# EAGLE design step_board (EAGLE 7.1.0)
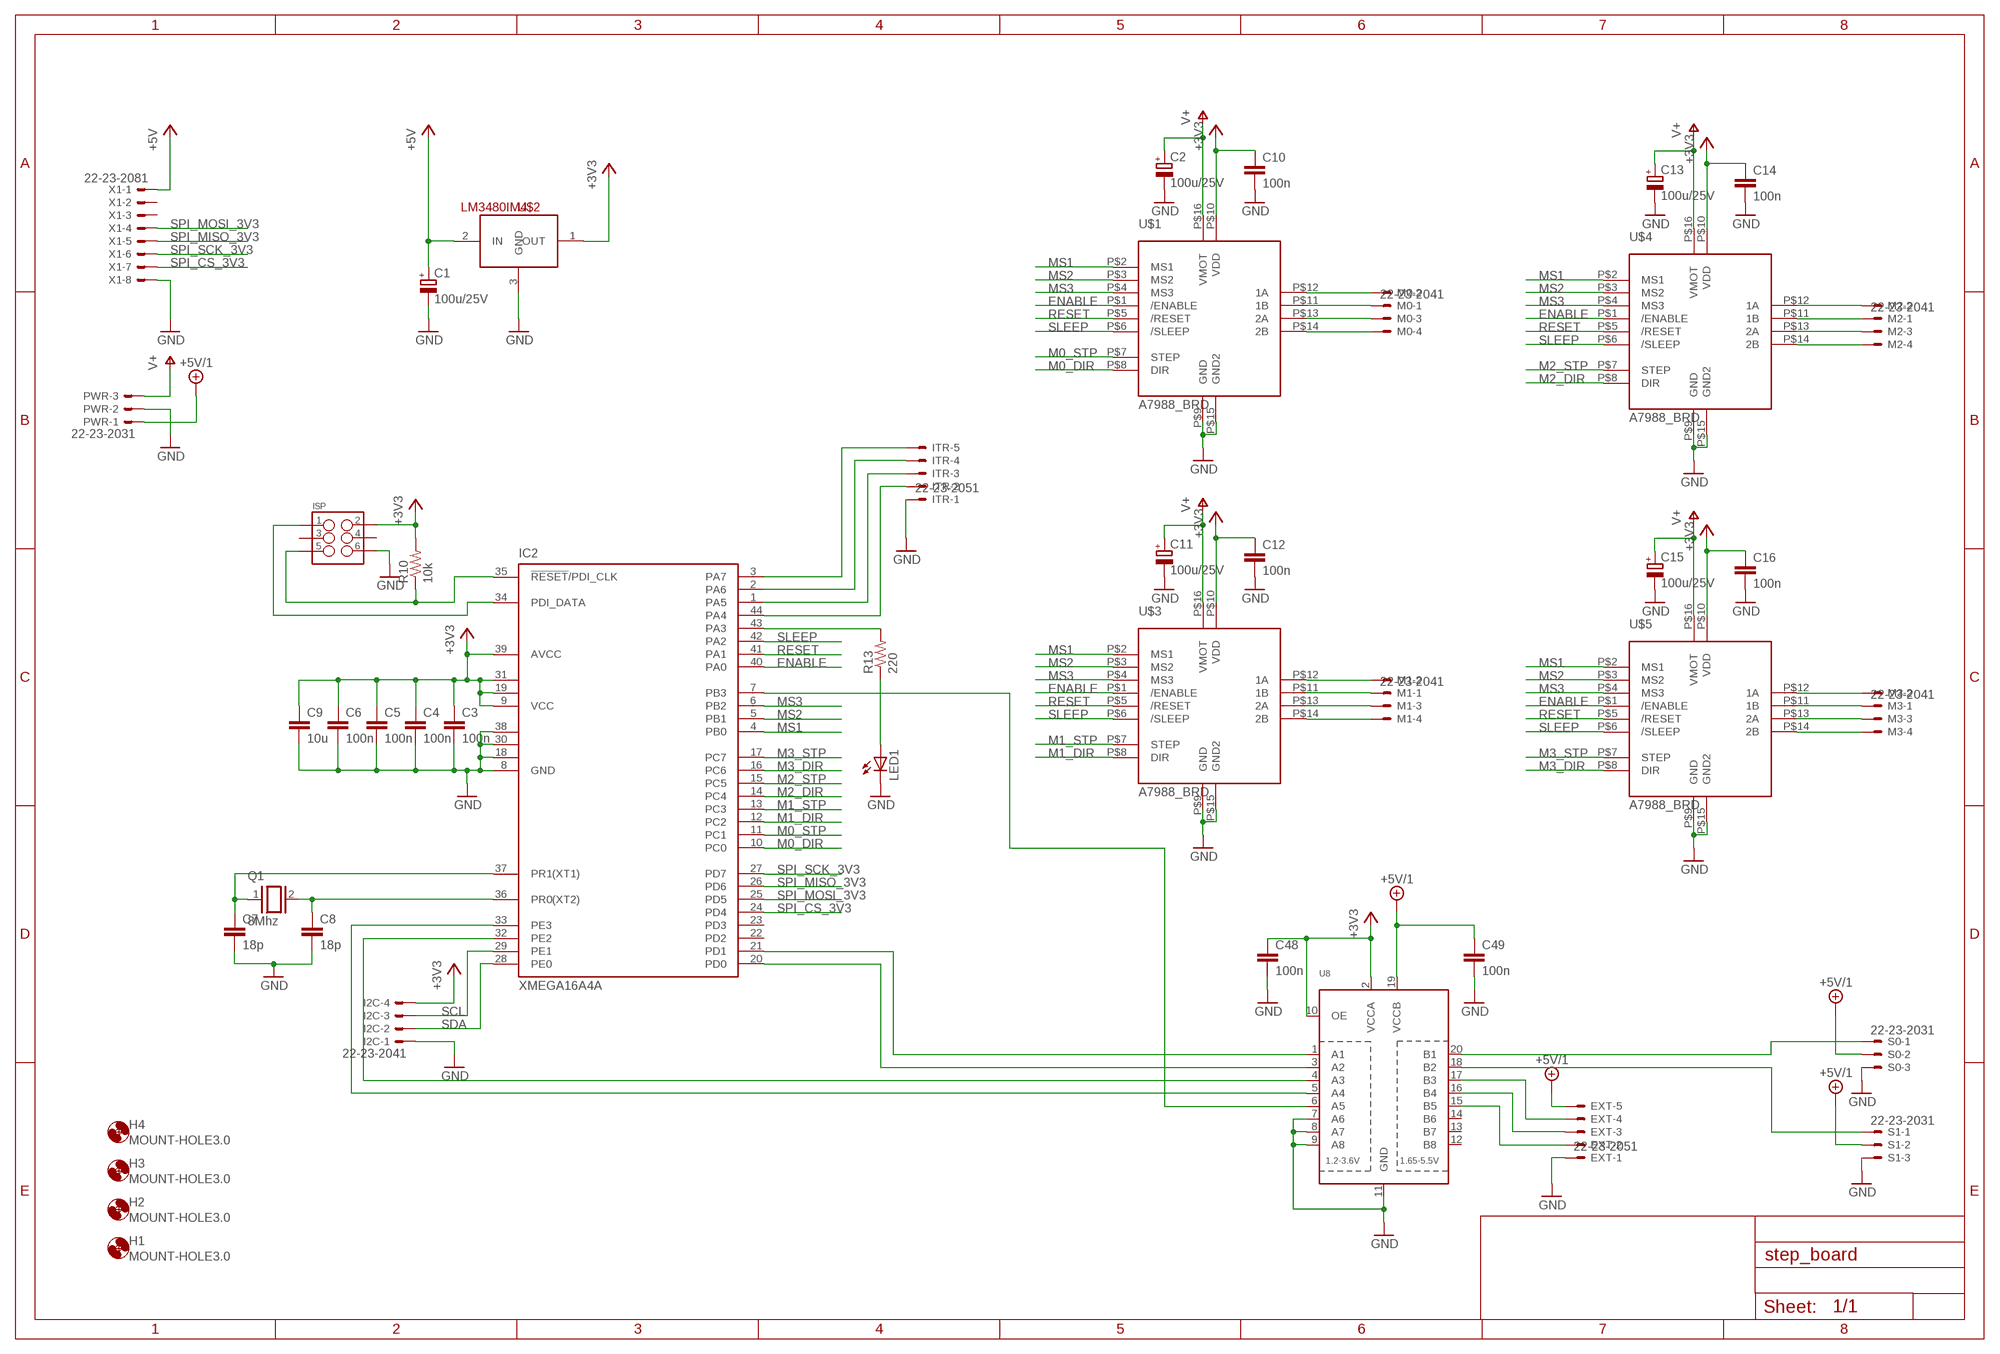
[diagram p0: schematic, sheet 1]

## Parts
C1  100u/25V  CPOL-EUE  [PANASONIC_E]
C2  100u/25V  CPOL-EUE  [PANASONIC_E]
C3  100n  C-EUC0603  [C0603]
C4  100n  C-EUC0603  [C0603]
C5  100n  C-EUC0603  [C0603]
C6  100n  C-EUC0603  [C0603]
C7  18p  C-EUC0603  [C0603]
C8  18p  C-EUC0603  [C0603]
C9  10u  C-EUC0805  [C0805]
C10  100n  C-EUC0603  [C0603]
C11  100u/25V  CPOL-EUE  [PANASONIC_E]
C12  100n  C-EUC0603  [C0603]
C13  100u/25V  CPOL-EUE  [PANASONIC_E]
C14  100n  C-EUC0603  [C0603]
C15  100u/25V  CPOL-EUE  [PANASONIC_E]
C16  100n  C-EUC0603  [C0603]
C48  100n  C-EUC0603K  [C0603K]
C49  100n  C-EUC0603K  [C0603K]
EXT  22-23-2051  [22-23-2051]
H1  MOUNT-HOLE3.0  [3,0]
H2  MOUNT-HOLE3.0  [3,0]
H3  MOUNT-HOLE3.0  [3,0]
H4  MOUNT-HOLE3.0  [3,0]
I2C  22-23-2041  [22-23-2041]
IC2  XMEGA16A4A  [TQFP44]
ISP  M03X2POGO_PINS  [2X3_POGO]
ITR  22-23-2051  [22-23-2051]
LED1  LEDCHIP-LED0603  [CHIP-LED0603]
M0  22-23-2041  [22-23-2041]
M1  22-23-2041  [22-23-2041]
M2  22-23-2041  [22-23-2041]
M3  22-23-2041  [22-23-2041]
PWR  22-23-2031  [22-23-2031]
Q1  8Mhz  XTAL/S  [QS]
R10  10k  R-US_R0603  [R0603]
R13  220  R-US_R0603  [R0603]
S0  22-23-2031  [22-23-2031]
S1  22-23-2031  [22-23-2031]
U8  TXB0108PWR  [TSSOP20]
U$1  A7988_BRD  [A4988_BRD]
U$2  LM3480IM4  [SOT23-3]
U$3  A7988_BRD  [A4988_BRD]
U$4  A7988_BRD  [A4988_BRD]
U$5  A7988_BRD  [A4988_BRD]
X1  22-23-2081  [22-23-2081]

## Nets
+3V3: C3.1 C4.1 C5.1 C6.1 C9.1 C10.1 C12.1 C14.1 C16.1 C48.1 I2C.4 IC2.9(VCC) IC2.19(VCC1) IC2.31(VCC2) IC2.39(AVCC) ISP.P$2 R10.2 U8.2(VCCA) U8.10(OE) U$1.P$10(VDD) U$2.1(OUT) U$3.P$10(VDD) U$4.P$10(VDD) U$5.P$10(VDD)
+5V: C1.+ U$2.2(IN) X1.1
+5V/1: C49.1 EXT.5 PWR.1 S0.2 S1.2 U8.19(VCCB)
ENABLE: IC2.40(PA0) U$1.P$1(/ENABLE) U$3.P$1(/ENABLE) U$4.P$1(/ENABLE) U$5.P$1(/ENABLE)
GND: C1.- C2.- C3.2 C4.2 C5.2 C6.2 C7.2 C8.2 C9.2 C10.2 C11.- C12.2 C13.- C14.2 C15.- C16.2 C48.2 C49.2 EXT.1 I2C.1 IC2.8(GND) IC2.18(GND1) IC2.30(GND2) IC2.38(GND3) ISP.P$6 ITR.1 LED1.C PWR.2 S0.3 S1.3 U8.7(A6) U8.8(A7) U8.9(A8) U8.11(GND) U$1.P$9(GND) U$1.P$15(GND2) U$2.3(GND) U$3.P$9(GND) U$3.P$15(GND2) U$4.P$9(GND) U$4.P$15(GND2) U$5.P$9(GND) U$5.P$15(GND2) X1.8
M0_DIR: IC2.10(PC0) U$1.P$8(DIR)
M0_STP: IC2.11(PC1) U$1.P$7(STEP)
M1_DIR: IC2.12(PC2) U$3.P$8(DIR)
M1_STP: IC2.13(PC3) U$3.P$7(STEP)
M2_DIR: IC2.14(PC4) U$4.P$8(DIR)
M2_STP: IC2.15(PC5) U$4.P$7(STEP)
M3_DIR: IC2.16(PC6) U$5.P$8(DIR)
M3_STP: IC2.17(PC7) U$5.P$7(STEP)
MS1: IC2.4(PB0) U$1.P$2(MS1) U$3.P$2(MS1) U$4.P$2(MS1) U$5.P$2(MS1)
MS2: IC2.5(PB1) U$1.P$3(MS2) U$3.P$3(MS2) U$4.P$3(MS2) U$5.P$3(MS2)
MS3: IC2.6(PB2) U$1.P$4(MS3) U$3.P$4(MS3) U$4.P$4(MS3) U$5.P$4(MS3)
N$1: M0.1 U$1.P$11(1B)
N$2: M0.2 U$1.P$12(1A)
N$3: M2.1 U$4.P$11(1B)
N$4: LED1.A R13.1
N$5: IC2.34(PDI_DATA) ISP.P$1
N$6: C8.1 IC2.36(PR0(XT2)) Q1.2
N$7: C7.1 IC2.37(PR1(XT1)) Q1.1
N$8: M2.2 U$4.P$12(1A)
N$9: M0.3 U$1.P$13(2A)
N$10: IC2.35(!RESET!/PDI_CLK) ISP.P$5 R10.1
N$11: M0.4 U$1.P$14(2B)
N$12: IC2.43(PA3) R13.2
N$13: M1.3 U$3.P$13(2A)
N$14: M1.4 U$3.P$14(2B)
N$15: M1.1 U$3.P$11(1B)
N$16: M1.2 U$3.P$12(1A)
N$17: M2.3 U$4.P$13(2A)
N$18: M2.4 U$4.P$14(2B)
N$19: M3.1 U$5.P$11(1B)
N$20: M3.2 U$5.P$12(1A)
N$21: M3.3 U$5.P$13(2A)
N$22: M3.4 U$5.P$14(2B)
N$23: S0.1 U8.20(B1)
N$24: IC2.20(PD0) U8.3(A2)
N$25: IC2.21(PD1) U8.1(A1)
N$26: S1.1 U8.18(B2)
N$27: IC2.32(PE2) U8.4(A3)
N$28: IC2.33(PE3) U8.5(A4)
N$29: IC2.44(PA4) ITR.2
N$30: EXT.4 U8.17(B3)
N$31: EXT.3 U8.16(B4)
N$32: EXT.2 U8.15(B5)
N$33: IC2.1(PA5) ITR.3
N$34: IC2.2(PA6) ITR.4
N$35: IC2.3(PA7) ITR.5
N$37: IC2.7(PB3) U8.6(A5)
RESET: IC2.41(PA1) U$1.P$5(/RESET) U$3.P$5(/RESET) U$4.P$5(/RESET) U$5.P$5(/RESET)
SCL: I2C.3 IC2.29(PE1)
SDA: I2C.2 IC2.28(PE0)
SLEEP: IC2.42(PA2) U$1.P$6(/SLEEP) U$3.P$6(/SLEEP) U$4.P$6(/SLEEP) U$5.P$6(/SLEEP)
SPI_CS_3V3: IC2.24(PD4) X1.7
SPI_MISO_3V3: IC2.26(PD6) X1.5
SPI_MOSI_3V3: IC2.25(PD5) X1.4
SPI_SCK_3V3: IC2.27(PD7) X1.6
V+: C2.+ C11.+ C13.+ C15.+ PWR.3 U$1.P$16(VMOT) U$3.P$16(VMOT) U$4.P$16(VMOT) U$5.P$16(VMOT)
Unconnected: IC2.22(PD2) IC2.23(PD3) ISP.P$3 ISP.P$4 U8.12(B8) U8.13(B7) U8.14(B6) X1.2 X1.3

## Library data of the parts
C1 C2 C11 C13 C15 = rcl:CPOL-EU: POLARIZED CAPACITOR, European symbol
C3-C10 C12 C14 C16 C48 C49 = rcl:C-EU: CAPACITOR, European symbol
EXT ITR = con-molex:22-23-2051: .100" (2.54mm) Center Header - 5 Pin; MF: MOLEX; MPN: 22-23-2051; OC_FARNELL: 1462952; OC_NEWARK: 38C9178
H1-H4 = holes:MOUNT-HOLE: MOUNTING HOLE with drill center marker
I2C M0 M1-M3 = con-molex:22-23-2041: .100" (2.54mm) Center Header - 4 Pin; MF: MOLEX; MPN: 22-23-2041; OC_FARNELL: 1462920; OC_NEWARK: 38C0355
IC2 = atmel:XMEGA16A4: MICROCONTROLLER Features High-performance, Low-power 8/16-bit AVR XMEGA Microcontroller Non-Volatile Program and Data Memories - 16 KB - 128 KB of In-System Self-Programmable Flash - 4 KB - 8 KB Boot Code Section with Independent Lock Bits - 1 KB - 2 KB EEPROM - 2 KB - 8 KB Internal SRAM Peripheral Features - Four-channel DMA Controller with support for external requests - Eight-channel Event System - Five 16-bit Timer/Counters Three Timer/Counters with 4 Output Compare or Input Capture channels Two Timer/Counters with 2 Output Compare or Input Capture channels High-Resolution Extensions on all Timer/Counters Advanced Waveform Extension on one Timer/Counter - Five USARTs IrDA Extension on one USART - Two Two-Wire Interfaces with dual address match (I2C and SMBus compatible) - Two SPIs (Serial Peripheral Interfaces) peripherals - AES and DES Crypto Engine - 16-bit Real Time Counter with Separate Oscillator - One Twelve-channel, 12-bit, 2 Msps Analog to Digital Converter - One Two-channel, 12-bit, 1 Msps Digital to Analog Converter - Two Analog Comparators with Window compare function - External Interrupts on all General Purpose I/O pins - Programmable Watchdog Timer with Separate On-chip Ultra Low Power Oscillator Special Microcontroller Features - Power-on Reset and Programmable Brown-out Detection - Internal and External Clock Options with PLL - Programmable Multi-level Interrupt Controller - Sleep Modes: Idle, Power-down, Standby, Power-save, Extended Standby - Advanced Programming, Test and Debugging Interfaces PDI (Program and Debug Interface) for programming, test and debugging I/O and Packages - 34 Programmable I/O Lines - 44 - lead TQFP - 44 - pad VQFN/QFN - 49 - ball VFBGA Operating Voltage - 1.6 - 3.6V Speed performance - 0 - 12 MHz @ 1.6 - 3.6V - 0 - 32 MHz @ 2.7 - 3.6V Drawn by Dipl.-Ing. (FH) Robert Siegler Created: 27.05.09; OC_FARNELL: unknown; OC_NEWARK: unknown
ISP = SparkFun-Connectors:M03X2: 2x3 .1" header. Shrouded, with keying- CONN-10681 SMT- CONN-11415 Pogo pins- HW-11044; PROD_ID: HW-11044
LED1 = led:LED: LED OSRAM: - CHIPLED LG R971, LG N971, LY N971, LG Q971, LY Q971, LO R971, LY R971 LH N974, LH R974 LS Q976, LO Q976, LY Q976 LO Q996 - Hyper CHIPLED LW Q18S LB Q993, LB Q99A, LB R99A - SideLED LS A670, LO A670, LY A670, LG A670, LP A670 LB A673, LV A673, LT A673, LW A673 LH A674 LY A675 LS A676, LA A676, LO A676, LY A676, LW A676 LS A679, LY A679, LG A679 - Hyper Micro SIDELED® LS Y876, LA Y876, LO Y876, LY Y876 LT Y87S - SmartLED LW L88C, LW L88S LB L89C, LB L89S, LG L890 LS L89K, LO L89K, LY L89K LS L896, LA L896, LO L896, LY L896 - TOPLED LS T670, LO T670, LY T670, LG T670, LP T670 LSG T670, LSP T670, LSY T670, LOP T670, LYG T670 LG T671, LOG T671, LSG T671 LB T673, LV T673, LT T673, LW T673 LH T674 LS T676, LA T676, LO T676, LY T676, LB T676, LH T676, LSB T676, LW T676 LB T67C, LV T67C, LT T67C, LS T67K, LO T67K, LY T67K, LW E67C LS E67B, LA E67B, LO E67B, LY E67B, LB E67C, LV E67C, LT E67C LW T67C LS T679, LY T679, LG T679 LS T770, LO T770, LY T770, LG T770, LP T770 LB T773, LV T773, LT T773, LW T773 LH T774 LS E675, LA E675, LY E675, LS T675 LS T776, LA T776, LO T776, LY T776, LB T776 LHGB T686 LT T68C, LB T68C - Hyper Mini TOPLED® LB M676 - Mini TOPLED Santana® LG M470 LS M47K, LO M47K, LY M47K Source: http://www.osram.convergy.de LUXEON: - LUMILED® LXK2-PW12-R00, LXK2-PW12-S00, LXK2-PW14-U00, LXK2-PW14-V00 LXK2-PM12-R00, LXK2-PM12-S00, LXK2-PM14-U00 LXK2-PE12-Q00, LXK2-PE12-R00, LXK2-PE12-S00, LXK2-PE14-T00, LXK2-PE14-U00 LXK2-PB12-K00, LXK2-PB12-L00, LXK2-PB12-M00, LXK2-PB14-N00, LXK2-PB14-P00, LXK2-PB14-Q00 LXK2-PR12-L00, LXK2-PR12-M00, LXK2-PR14-Q00, LXK2-PR14-R00 LXK2-PD12-Q00, LXK2-PD12-R00, LXK2-PD12-S00 LXK2-PH12-R00, LXK2-PH12-S00 LXK2-PL12-P00, LXK2-PL12-Q00, LXK2-PL12-R00 Source: www.luxeon.com KINGBRIGHT: KA-3528ASYC Source: www.kingbright.com
PWR S0 S1 = con-molex:22-23-2031: .100" (2.54mm) Center Header - 3 Pin; MF: MOLEX; MPN: 22-23-2031; OC_FARNELL: 1462950; OC_NEWARK: 30C0862
Q1 = special:XTAL/S: CRYSTAL
R10 R13 = rcl:R-US_: RESISTOR, American symbol
U8 = adafruit:TXB0108PWR: 8-Bit Bi-Directional Level Shifter 1.2V-3.6V (VCCA) to 1.65V-5.5V (VCCB) bi-directional level shifter with auto direction sensing. Max data rate - VCCA 1.8V: 20Mbps (50ns), VCCA 3.3V: 100Mbps (10ns) Digikey: 296-21527-1-ND
U$1 U$3-U$5 = perso:A7988_BRD
U$2 = SparkFun-PowerIC:LM3480IM4: Small package linear regulator
X1 = con-molex:22-23-2081: .100" (2.54mm) Center Header - 8 Pin; MF: MOLEX; MPN: 22-23-2081; OC_FARNELL: 1756826; OC_NEWARK: 01C7592

## Board
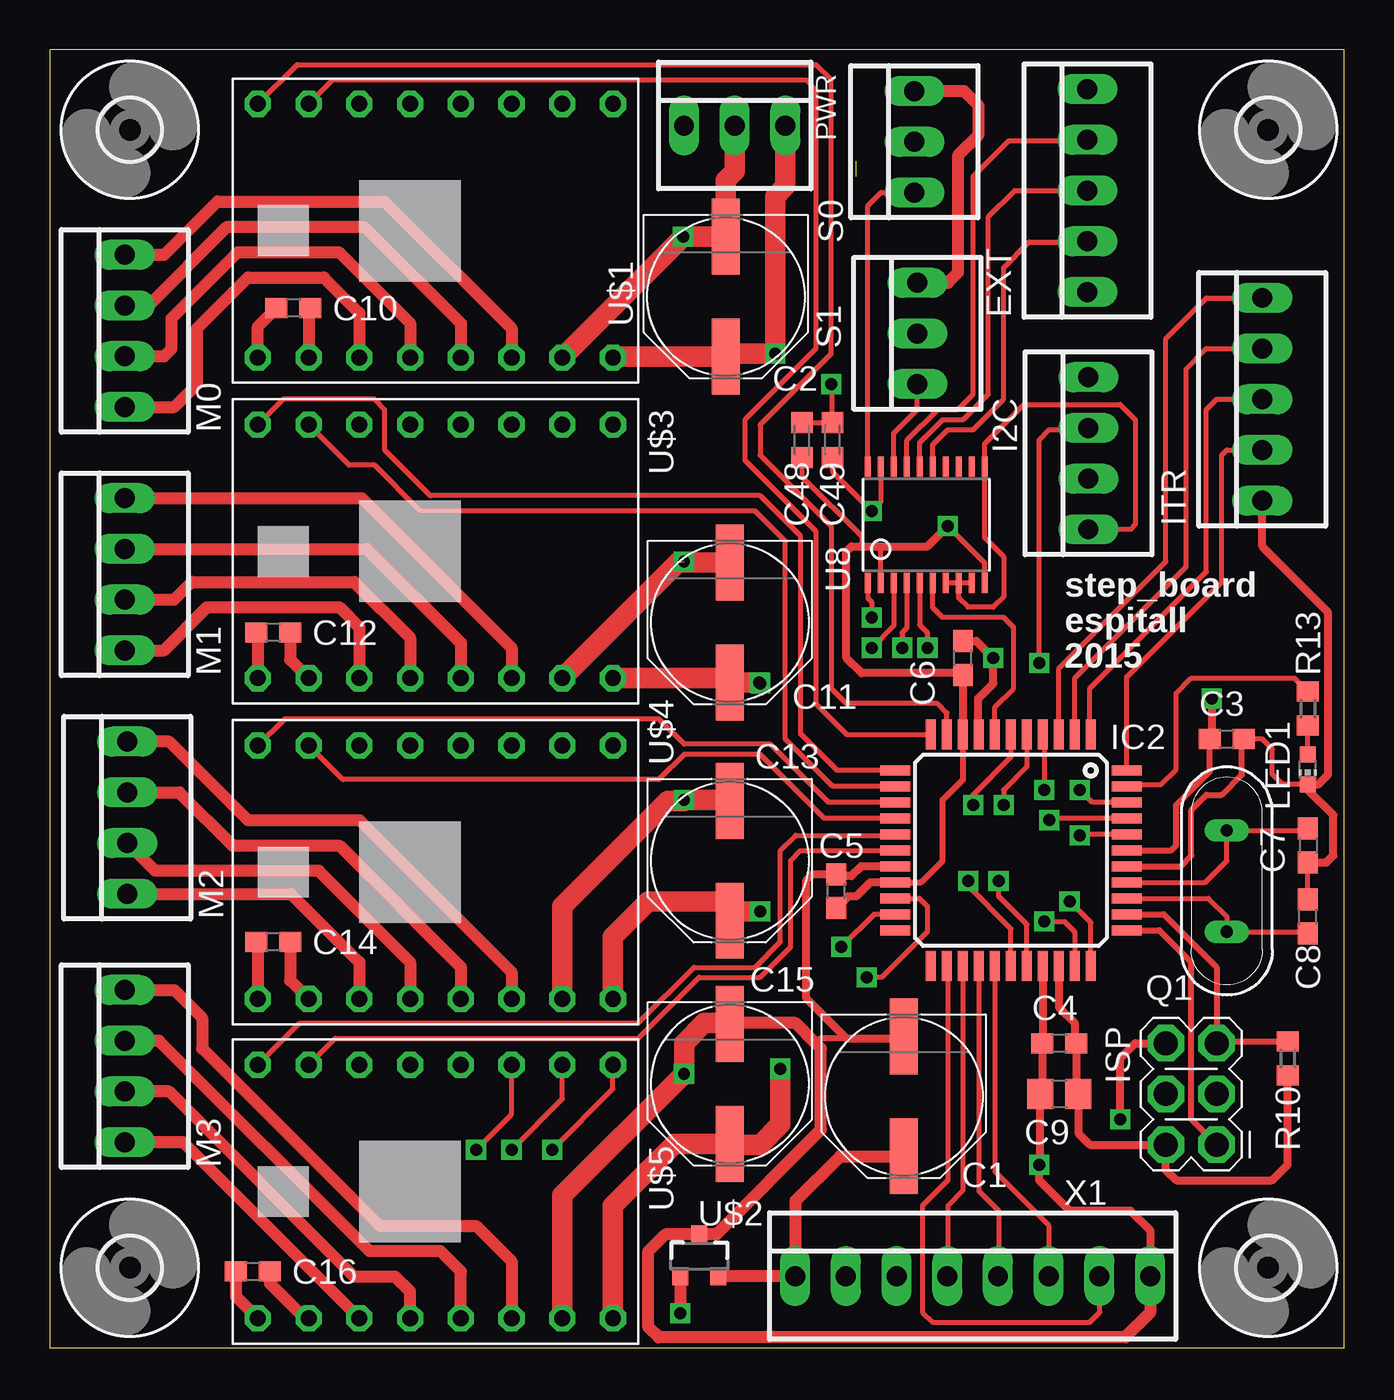
[diagram p1: board, top side]
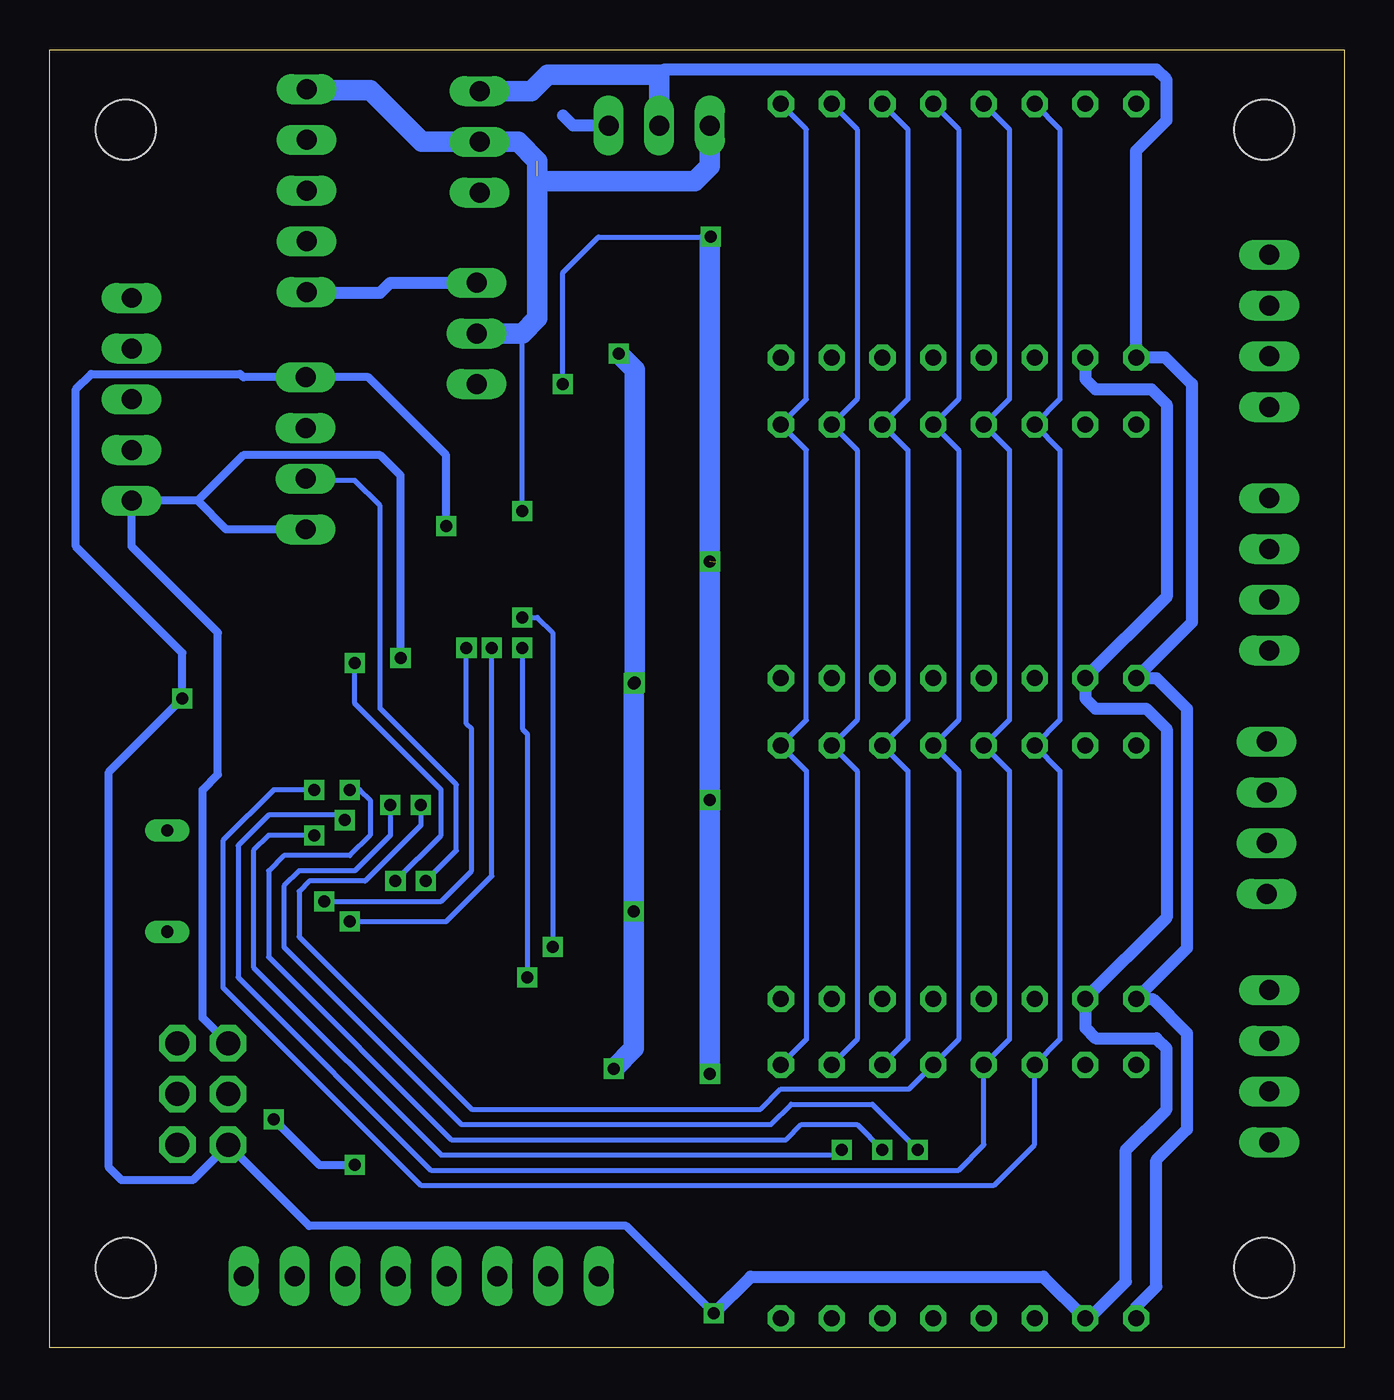
[diagram p2: board, bottom side, seen from below]

Size 64.8 x 65 mm. Coordinates in mm from the lower left corner, seen from the top.
Outline: 0,0 64.8,0 64.8,65 0,65 0,0
Copper layers (1*16): Top 0.035mm / dielectric 1.5mm / Bottom 0.035mm
Design rules "default": minimum track width 10mil, minimum drill 24mil, track to track 8mil, track to pad 8mil, pad to pad 8mil, via to via 8mil, smd to smd 8mil, copper to edge 40mil, drill to drill 8mil, minimum pad ring 10mil, minimum via ring 8mil, stop-mask expansion 4mil, vias tented up to drill 0mil, thermal gap 10mil

### Footprints (pad centres in the part's own frame; a part is rotated, then mirrored left to right if it is on the bottom)
PANASONIC_E = smd 3.8 x 1.4: + 3,0; - -3,0
C0603 = smd 1.1 x 1: 1 -0.85,0; 2 0.85,0
C0805 = smd 1.3 x 1.5: 1 -0.95,0; 2 0.95,0
C0603K = smd 1.05 x 1.08: 1 -0.875,0; 2 0.875,0
22-23-2051 = drill 1 long: 1 -5.08,0; 2 -2.54,0; 3 0,0; 4 2.54,0; 5 5.08,0
3,0 = hole 3: 0,0
22-23-2041 = drill 1 long: 1 -3.81,0; 2 -1.27,0; 3 1.27,0; 4 3.81,0
TQFP44 = smd 1.5 x 0.5: 1 -5.8,4; 2 -5.8,3.2; 3 -5.8,2.4; 4 -5.8,1.6; 5 -5.8,0.8; 6 -5.8,0; 7 -5.8,-0.8; 8 -5.8,-1.6; 9 -5.8,-2.4; 10 -5.8,-3.2; 11 -5.8,-4; 23 5.8,-4; 24 5.8,-3.2; 25 5.8,-2.4; 26 5.8,-1.6; 27 5.8,-0.8; 28 5.8,0; 29 5.8,0.8; 30 5.8,1.6; 31 5.8,2.4; 32 5.8,3.2; 33 5.8,4 | smd 0.5 x 1.5: 12 -4,-5.8; 13 -3.2,-5.8; 14 -2.4,-5.8; 15 -1.6,-5.8; 16 -0.8,-5.8; 17 0,-5.8; 18 0.8,-5.8; 19 1.6,-5.8; 20 2.4,-5.8; 21 3.2,-5.8; 22 4,-5.8; 34 4,5.8; 35 3.2,5.8; 36 2.4,5.8; 37 1.6,5.8; 38 0.8,5.8; 39 0,5.8; 40 -0.8,5.8; 41 -1.6,5.8; 42 -2.4,5.8; 43 -3.2,5.8; 44 -4,5.8
2X3_POGO = drill 1.2 pad 1.829 octagon: P$1 0,0; P$2 0,2.54; P$3 2.54,0; P$4 2.54,2.54; P$5 5.08,0; P$6 5.08,2.54
CHIP-LED0603 = smd 0.8 x 0.8: A 0,-0.75; C 0,0.75
22-23-2031 = drill 1 long: 1 -2.54,0; 2 0,0; 3 2.54,0
QS = drill 0.61 long: 1 -2.54,0; 2 2.54,0
R0603 = smd 1 x 1.1: 1 -0.85,0; 2 0.85,0
TSSOP20 = smd 0.305 x 0.991: 1 -2.925,-2.918; 2 -2.275,-2.918; 3 -1.625,-2.918; 4 -0.975,-2.918; 5 -0.325,-2.918; 6 0.325,-2.918; 7 0.975,-2.918; 8 1.625,-2.918; 9 2.275,-2.918; 10 2.925,-2.918; 11 2.925,2.918; 12 2.275,2.918; 13 1.625,2.918; 14 0.975,2.918; 15 0.325,2.918; 16 -0.325,2.918; 17 -0.975,2.918; 18 -1.625,2.918; 19 -2.275,2.918; 20 -2.925,2.918
A4988_BRD = drill 0.8 octagon: P$1 -6.35,8.89; P$2 -6.35,6.35; P$3 -6.35,3.81; P$4 -6.35,1.27; P$5 -6.35,-1.27; P$6 -6.35,-3.81; P$7 -6.35,-6.35; P$8 -6.35,-8.89; P$9 6.35,-8.89; P$10 6.35,-6.35; P$11 6.35,-3.81; P$12 6.35,-1.27; P$13 6.35,1.27; P$14 6.35,3.81; P$15 6.35,6.35; P$16 6.35,8.89
SOT23-3 = smd 0.8 x 0.9: 1 -0.95,-1; 2 0.95,-1; 3 0,1.1
22-23-2081 = drill 1 long: 1 -8.89,0; 2 -6.35,0; 3 -3.81,0; 4 -1.27,0; 5 1.27,0; 6 3.81,0; 7 6.35,0; 8 8.89,0

### Placement (x,y rotation side)
C1  42.75,12.59 270 top
C2  33.85,52.64 270 top
C3  58.93,30.48 0 top
C4  50.55,15.24 180 top
C5  39.37,22.86 90 top
C6  45.72,34.54 90 top
C7  62.99,25.15 270 top
C8  62.99,21.59 90 top
C9  50.55,12.7 180 top
C10  12.19,52.07 180 top
C11  34.04,36.32 270 top
C12  11.18,35.81 180 top
C13  34.04,24.38 270 top
C14  11.18,20.32 180 top
C15  34.04,13.21 270 top
C16  10.16,3.81 180 top
C48  37.66,45.47 90 top
C49  39.18,45.47 90 top
EXT  51.95,57.95 90 top
H1  4,4 0 top
H2  61,4 0 top
H3  61,61 0 top
H4  4,61 0 top
I2C  52,44.8 90 top
IC2  48.12,24.91 270 top
ISP  58.42,10.16 90 top
ITR  60.71,47.5 90 top
LED1  62.99,28.96 180 top
M0  3.75,50.93 90 top
M1  3.75,38.73 90 top
M2  3.87,26.54 90 top
M3  3.75,14.1 90 top
PWR  34.29,61.21 0 top
Q1  58.93,23.37 270 top
R10  61.98,14.48 270 top
R13  62.99,32 90 top
S0  43.28,60.4 90 top
S1  43.43,50.8 90 top
U8  43.88,41.21 0 top
U$1  19.3,55.94 270 top
U$2  32.51,4.57 0 top
U$3  19.3,39.88 270 top
U$4  19.3,23.81 270 top
U$5  19.3,7.81 270 top
X1  46.2,3.58 0 top

### Tracks (layer width: path | path; a pad name or v marks a point on that pad's centre or on a via)
+3V3  (via drill 0.6)
  Top 0.254: C48.1 37.66,43.62 40.64,40.64 40.64,40.13 | U8.10 46.8,39.3 v44.96,41.15 | U8.2 41.6,39.93 41.4,40.13
  Top 0.305: IC2.39 56.15,24.91 56.39,25.15 56.39,27.18 58.08,28.87 C3.1 | IC2.19 43.63,23.31 44.7,24.38 44.7,27.43 45.72,28.45 IC2.9
  Top 0.406: IC2.31 50.52,17.05 51.31,16.26 51.31,15.33 C4.1 51.4,12.8 C9.1 51.5,10.73 52.07,10.16 ISP.P$2 55.88,8.89 56.39,8.38 61.21,8.38 61.98,9.14 R10.2 | IC2.9 C6.1 45.63,33.78 40.64,33.78 39.88,34.54 39.88,39.88 40.13,40.13 40.64,40.13 41.4,40.13 43.94,40.13 v44.96,41.15 | IC2.19 41.09,23.31 40.39,22.61 39.97,22.61 C5.1 | v58.17,32.51 58.17,30.57 C3.1
  Top 0.61: C16.1 11.01,3.21 12.76,1.46 U$5.P$10 | C14.1 12.03,18.39 U$4.P$10 | C12.1 12.03,34.46 U$3.P$10 | C10.1 12.95,51.98 U$1.P$10 | U$2.1 v31.56,1.71
  Bottom 0.406: v31.56,1.71 35.95,6.1 51.82,6.1 ISP.P$2 57.66,8.38 61.21,8.38 61.85,9.02 61.85,28.83 v58.17,32.51 58.17,34.8 63.5,40.13 63.5,48.01 62.74,48.77 55.28,48.77 55.12,48.61 I2C.4 48.86,48.61 44.96,44.7 v44.96,41.15
  Bottom 0.61: U$1.P$10 12.95,48.51 12.45,48.01 9.65,48.01 8.89,47.24 8.89,37.59 U$3.P$10 12.95,32.51 12.45,32 9.91,32 8.89,30.99 8.89,21.53 U$4.P$10 12.95,16 12.45,15.49 9.4,15.49 8.89,14.99 8.89,11.94 10.92,9.91 10.92,3.3 12.76,1.46 U$5.P$10 15.05,3.56 29.72,3.56 v31.56,1.71
+5V
  Top 0.406: X1.1 37.34,3.6
  Top 0.61: U$2.2 X1.1 37.34,3.6 37.34,7.37 39.56,9.59 C1.+
+5V/1  (via drill 0.6)  (1 unrouted)
  Top 0.254: U8.19 41.6,42.37 v41.15,41.91 39.18,43.88 C49.1
  Bottom 0.254: v41.15,41.91 41.15,50.8 41.15,51.31
  Bottom 1.016: PWR.1 31.75,59.18 32.51,58.42 40.13,58.42 40.39,58.67 | S1.2 41.15,50.8 40.39,51.56 40.39,59.44 41.35,60.4 S0.2 46.17,60.4 48.77,62.99 51.91,62.99 EXT.5
ENABLE  (via drill 0.6)
  Top 0.254: IC2.40 51.62,25.71 v51.56,25.65 | v25.15,9.91 28.19,12.95 U$5.P$1
  Bottom 0.254: U$5.P$1 26.92,15.43 26.92,28.89 U$4.P$1 26.92,31.43 26.92,44.96 U$3.P$1 26.92,47.5 26.92,61.02 U$1.P$1 | v51.56,25.65 53.85,25.65 54.61,24.89 54.61,19.05 45.21,9.65 25.4,9.65 v25.15,9.91
GND  (via drill 0.6)  (1 unrouted)
  Top 0.254: C8.2 C7.2 | LED1.C 62.98,28.19 61.72,28.19 61.21,28.7 61.21,29.97 60.71,30.48 C3.2 | U8.9 U8.8 | U8.8 U8.7 | U8.8 45.5,37.55 45.97,37.08 47.24,37.08 47.75,37.59 47.75,39.62 46.8,40.57 U8.11 46.8,45.28 48.77,47.24 53.59,47.24 54.36,46.48 54.36,41.24 54.1,40.99 I2C.1 | C48.2 C49.2 39.18,48.2 v39.12,48.26
  Top 0.305: IC2.38 56.62,24.11 57.15,24.64 57.15,26.92 57.91,27.69 58.67,27.69 59.69,28.7 59.69,30.39 C3.2 | 39.88,15.49 38.61,15.49 38.35,15.24
  Top 0.406: IC2.30 49.72,15.26 C4.2 49.7,12.8 C9.2 49.6,9.21 v49.53,9.14 49.53,8.38 51.05,6.86 54.1,6.86 55.12,5.84 55.12,3.6 X1.8 | IC2.8 46.48,30.74 46.48,32.51 47.24,33.27 v47.24,34.54 46.39,35.39 C6.2 | IC2.18 40.62,24.11 40.13,23.62 39.46,23.62 C5.2 38.19,23.71 37.85,23.37 37.85,17.53 39.88,15.49 42.66,15.49 C1.- | ITR.1 60.71,40.13 64.01,36.83 64.01,28.7 63.51,28.21 LED1.C 62.99,27.94 64.26,26.67 64.26,24.64 63.92,24.3 C7.2 | v53.59,11.43 53.59,14.48 54.36,15.24 ISP.P$6
  Top 0.61: C16.2 9.31,2.56 U$5.P$9 | C14.2 10.41,20.23 U$4.P$9 | C12.2 10.41,35.73 U$3.P$9 | U$1.P$9 10.41,51.14 C10.2 | X1.8 55.09,1.75 53.85,0.51 30.48,0.51 29.97,1.02 29.97,4.83 30.82,5.67 U$2.3 33.36,5.67 38.61,10.92 38.61,14.99 38.35,15.24 37.34,16.26 34.08,16.26 C15.- | S1.3 44.96,53.34 45.47,53.85 45.47,59.69 46.48,60.71 46.48,62.23 45.77,62.94 S0.3
  Top 1.016: U$3.P$15 31.45,39.32 C11.- | U$1.P$15 v31.7,55.64 C2.- 33.85,58.48 34.29,58.93 PWR.2 | U$5.P$15 25.65,7.62 v31.75,13.72 31.75,15.24 32.77,16.26 34.04,16.26 C15.- 34.04,14.99 | 33.83,28.19 C13.- 33.99,27.43 v31.75,27.43 31.75,27.38 30.94,27.38 25.65,22.1 U$4.P$15
  Bottom 0.254: v39.12,48.26 39.12,53.85 37.34,55.63 31.72,55.63 v31.7,55.64
  Bottom 0.406: v53.59,11.43 51.31,9.14 v49.53,9.14 | ISP.P$6 57.15,16.51 57.15,27.94 56.39,28.7 56.39,35.81 60.71,40.13 ITR.1 57.4,42.42 | I2C.1 55.97,40.99 57.4,42.42 | v47.24,34.54 47.24,43.69 48.26,44.7 55.12,44.7 57.4,42.42
  Bottom 0.61: EXT.1 51.91,52.83 48.26,52.83 47.75,53.34 S1.3 | U$5.P$9 10.41,2.03 9.4,3.05 9.4,9.4 7.87,10.92 7.87,15.75 9.59,17.46 U$4.P$9 7.87,20 7.87,32 9.4,33.53 U$3.P$9 7.62,36.32 7.62,48.26 8.95,49.59 U$1.P$9 10.41,59.94 8.89,61.47 8.89,63.5 9.4,64.01 34.04,64.01 34.29,63.75
  Bottom 1.016: v31.7,55.64 31.75,55.59 v31.75,39.37 | v31.75,39.37 31.75,39.32 | v31.75,13.72 v31.75,27.43 v31.75,39.37 | S0.3 40.69,62.94 39.88,63.75 34.29,63.75 PWR.2
M0_DIR
  Top 0.254: U$1.P$8 12.38,64.26 38.35,64.26 39.12,63.5 39.12,49.78 35.56,46.23 35.56,44.7 39.12,41.15 39.12,33.02 39.88,32.26 44.45,32.26 44.92,31.79 IC2.10
M0_STP
  Top 0.254: U$1.P$7 14.16,63.5 37.85,63.5 38.35,62.99 38.35,50.04 34.8,46.48 34.8,44.45 38.35,40.89 38.35,32.26 39.91,30.71 IC2.11
M1_DIR
  Top 0.254: IC2.12 39.42,28.91 37.59,30.73 37.59,40.64 35.56,42.67 19.05,42.67 16.76,44.96 16.76,46.99 16.26,47.5 11.68,47.5 U$3.P$8
M1_STP
  Top 0.254: IC2.13 39.2,28.11 36.83,30.48 36.83,40.39 35.31,41.91 18.54,41.91 16.26,44.2 14.99,44.2 U$3.P$7
M2_DIR
  Top 0.254: IC2.14 38.99,27.31 36.07,30.23 31.75,30.23 30.48,31.5 11.75,31.5 U$4.P$8
M2_STP
  Top 0.254: IC2.15 38.77,26.51 35.56,29.72 31.75,29.72 30.48,28.45 14.67,28.45 U$4.P$7
M3_DIR
  Top 0.254: U$5.P$8 12.51,16.26 29.46,16.26 32.26,19.05 35.31,19.05 36.58,20.32 36.58,24.89 37.34,25.65 42.26,25.65 IC2.16
M3_STP
  Top 0.254: U$5.P$7 14.29,15.49 29.46,15.49 32.51,18.54 35.56,18.54 37.08,20.07 37.08,24.38 37.59,24.89 42.3,24.89 IC2.17
MS1  (via drill 0.6)
  Top 0.254: IC2.4 49.78,30.64 v49.78,27.94 | v23.11,9.91 25.65,12.45 U$5.P$2
  Bottom 0.254: U$1.P$2 24.38,61.02 24.38,47.5 U$3.P$2 24.38,44.96 24.38,31.43 U$4.P$2 24.38,28.89 24.38,15.43 U$5.P$2 | v49.78,27.94 49.28,27.94 48.77,27.43 48.77,25.65 49.78,24.64 53.09,24.64 53.85,23.88 53.85,19.56 44.7,10.41 27.94,10.41 27.18,11.18 24.38,11.18 v23.11,9.91 23.62,10.41
MS2  (via drill 0.6)
  Top 0.254: IC2.5 48.92,29.11 47.75,27.94 v47.75,27.18 | v21.34,9.91 23.11,11.68 U$5.P$3
  Bottom 0.254: U$1.P$3 21.84,61.02 21.84,47.5 U$3.P$3 21.84,44.96 21.84,31.43 U$4.P$3 21.84,28.89 21.84,15.43 U$5.P$3 | v47.75,27.18 47.75,25.65 49.53,23.88 52.32,23.88 53.09,23.11 53.09,20.07 44.2,11.18 28.7,11.18 27.69,12.19 23.62,12.19 v21.34,9.91
MS3  (via drill 0.6)
  Top 0.254: IC2.6 48.12,29.57 46.23,27.69 v46.23,27.18
  Bottom 0.254: U$1.P$4 19.3,61.02 19.3,47.5 U$3.P$4 19.3,44.96 19.3,31.43 U$4.P$4 19.3,28.89 19.3,15.43 U$5.P$4 21.78,12.95 28.19,12.95 29.21,11.94 43.69,11.94 52.32,20.57 52.32,22.86 51.82,23.37 49.02,23.37 46.23,26.16 v46.23,27.18
N$1
  Top 0.61: M0.1 6.22,47.12 7.37,48.26 7.37,51.05 9.91,53.59 13.72,53.59 15.49,51.82 U$1.P$11
N$2
  Top 0.61: M0.2 5.71,49.66 6.1,50.04 6.1,51.56 9.4,54.86 14.48,54.86 18.03,51.31 U$1.P$12
N$3
  Top 0.61: M2.1 12.06,22.73 15.49,19.3 U$4.P$11
N$4
  Top 0.254: LED1.A R13.1
N$5
  Top 0.305: ISP.P$1 57.15,11.43 57.15,19.3 55.55,20.91 IC2.34
N$6
  Top 0.254: IC2.36 58.01,22.51 58.93,21.59 Q1.2 62.9,20.83 C8.1
N$7
  Top 0.254: IC2.37 57.85,23.31 58.93,24.38 Q1.1 62.9,25.91 C7.1
N$8
  Top 0.61: U$4.P$12 18.03,19.3 13.46,23.88 5.27,23.88 M2.2
N$9
  Top 0.61: M0.3 4.95,52.2 8.89,56.13 15.75,56.13 20.57,51.31 U$1.P$13
N$10
  Top 0.305: IC2.35 55.76,21.71 58.42,19.05 ISP.P$5 58.51,15.33 R10.1
N$11
  Top 0.61: M0.4 5.71,54.74 8.38,57.4 16.76,57.4 23.11,51.05 U$1.P$14
N$12
  Top 0.254: IC2.43 54,28.19 55.63,28.19 56.39,28.96 56.39,32.77 57.15,33.53 62.32,33.53 R13.2
N$13
  Top 0.61: M1.3 15.88,40.01 20.57,35.31 U$3.P$13
N$14
  Top 0.61: M1.4 15.62,42.55 23.11,35.05 U$3.P$14
N$15
  Top 0.61: M1.1 5.71,34.92 7.87,37.08 14.48,37.08 15.49,36.07 U$3.P$11
N$16
  Top 0.61: M1.2 6.22,37.47 7.11,38.35 15.24,38.35 18.03,35.56 U$3.P$12
N$17
  Top 0.61: U$4.P$13 20.57,19.05 14.48,25.15 9.14,25.15 6.48,27.81 M2.3
N$18
  Top 0.61: U$4.P$14 23.11,18.8 15.49,26.42 9.91,26.42 5.97,30.35 M2.4
N$19
  Top 0.61: U$5.P$11 6.67,10.29 M3.1
N$20
  Top 0.61: U$5.P$12 18.03,2.79 17.27,3.56 15.24,3.56 5.97,12.83 M3.2
N$21
  Top 0.61: U$5.P$13 20.57,3.81 19.56,4.83 16,4.83 5.46,15.37 M3.3
N$22
  Top 0.61: M3.4 6.22,17.91 7.62,16.51 7.62,14.99 16.51,6.1 21.34,6.1 23.11,4.32 U$5.P$14
N$23
  Top 0.254: U8.20 40.95,57.21 41.6,57.86 S0.1
N$24  (via drill 0.6)
  Top 0.254: U8.3 42.25,36.16 v41.15,35.05 | IC2.20 43.53,22.51 43.94,22.1 43.94,20.83 41.66,18.54 v40.89,18.54
  Bottom 0.254: v41.15,35.05 41.15,30.99 40.89,30.73 v40.89,18.54
N$25  (via drill 0.6)
  Top 0.254: IC2.21 41.27,21.71 v39.62,20.07 | U8.1 40.95,37.53 41.15,37.34 v41.15,36.58
  Bottom 0.254: v41.15,36.58 40.39,36.58 39.62,35.81 v39.62,20.07
N$26
  Top 0.254: U8.18 42.25,45.81 43.43,46.99 S1.1
N$27  (via drill 0.6)
  Top 0.254: v49.78,21.34 50.8,21.34 51.31,20.83 51.31,19.12 IC2.32 | U8.4 42.9,36.05 42.67,35.81 v42.67,35.05
  Bottom 0.254: v49.78,21.34 44.96,21.34 42.67,23.62 v42.67,35.05
N$28  (via drill 0.6)
  Top 0.254: IC2.33 52.12,21.29 v51.05,22.35 | U8.5 43.55,36.2 43.94,35.81 v43.94,35.05
  Bottom 0.254: v51.05,22.35 45.21,22.35 43.69,23.88 43.69,30.99 43.94,31.24 v43.94,35.05
N$29
  Top 0.254: IC2.44 53.92,33.6 58.67,38.35 58.67,44.7 58.93,44.96 ITR.2
N$30
  Top 0.254: U8.17 42.9,45.44 44.45,46.99 45.47,46.99 46.23,47.75 46.23,58.67 48.01,60.45 51.91,60.45 EXT.4
N$31
  Top 0.254: U8.16 43.55,45.33 44.7,46.48 45.72,46.48 46.99,47.75 46.99,56.64 48.3,57.95 EXT.3
N$32
  Top 0.254: U8.15 44.2,45.22 44.96,45.97 46.23,45.97 47.75,47.5 47.75,54.1 49.02,55.37 51.91,55.37 EXT.2
N$33
  Top 0.254: IC2.1 52.07,30.75 52.07,33.02 57.91,38.86 57.91,46.99 58.42,47.5 ITR.3
N$34
  Top 0.254: IC2.2 51.32,33.54 56.9,39.12 56.9,49.02 57.91,50.04 ITR.4
N$35
  Top 0.254: IC2.3 50.52,34.01 55.88,39.37 55.88,50.55 57.91,52.58 ITR.5
N$37
  Top 0.254: U8.6 44.2,37.08 44.7,36.58 47.75,36.58 48.26,36.07 48.26,33.02 47.32,32.08 IC2.7
RESET  (via drill 0.6)
  Top 0.254: IC2.41 50.13,26.51 v50.04,26.42
  Bottom 0.254: U$1.P$5 16.76,61.02 16.76,47.5 U$3.P$5 16.76,44.96 16.76,31.43 U$4.P$5 16.76,28.89 16.76,15.43 U$5.P$5 18.03,10.16 19.3,8.89 45.72,8.89 55.37,18.54 55.37,25.15 53.85,26.67 50.29,26.67 v50.04,26.42
SCL  (via drill 0.6)
  Top 0.254: IC2.29 48.92,21.19 47.5,22.61 v47.5,23.37 | v49.53,34.29 49.53,45.47 50.04,45.97 51.91,45.97 I2C.3
  Bottom 0.254: v47.5,23.37 45.21,25.65 45.21,27.94 49.53,32.26 v49.53,34.29
SDA  (via drill 0.6)
  Top 0.254: IC2.28 48.12,20.97 45.97,23.11 v45.97,23.37
  Bottom 0.254: v45.97,23.37 44.45,24.89 44.45,28.19 48.26,32 48.26,42.16 49.53,43.43 51.91,43.43 I2C.2
SLEEP  (via drill 0.6)
  Top 0.254: IC2.42 52.2,27.31 v51.56,27.94
  Bottom 0.254: U$1.P$6 14.22,61.02 14.22,47.5 U$3.P$6 14.22,44.96 14.22,31.43 U$4.P$6 14.22,28.89 14.22,15.43 U$5.P$6 15.49,10.16 17.53,8.13 46.23,8.13 56.13,18.03 56.13,25.4 53.59,27.94 v51.56,27.94
SPI_CS_3V3
  Top 0.254: IC2.24 44.96,19.07 44.96,8.38 43.69,7.11 43.69,1.78 44.2,1.27 52.07,1.27 52.58,1.78 52.58,3.55 X1.7
SPI_MISO_3V3
  Top 0.254: IC2.26 46.52,7.84 47.5,6.86 47.5,3.6 X1.5
SPI_MOSI_3V3
  Top 0.254: IC2.25 45.72,7.87 44.96,7.11 44.96,3.6 X1.4
SPI_SCK_3V3
  Top 0.254: IC2.27 47.32,8.82 50.01,6.12 X1.6
V+  (via drill 0.6)
  Top 1.016: U$1.P$16 28.24,49.64 C2.+ 33.99,49.78 v36.32,49.78 36.32,57.66 36.83,58.17 PWR.3 | U$3.P$16 33.83,33.53 C11.+ v35.51,33.32 v35.56,33.27 | U$5.P$16 28.19,7.11 31.29,10.21 C15.+ 34.08,10.16 35.56,10.16 36.58,11.18 v36.58,13.97 | U$4.P$16 28.19,20.57 29.97,22.35 33.99,22.35 | 33.99,22.35 C13.+ | 33.99,22.35 34.5,21.84 v35.56,21.84
  Bottom 0.61: PWR.3 38.61,61.21 39.12,61.72
  Bottom 1.016: v36.58,13.97 35.56,14.99 v35.56,21.84 v35.56,33.27 | v35.51,33.32 35.51,48.97 v36.32,49.78

### Text on the board
tPlace: step_board | espitall | 2015